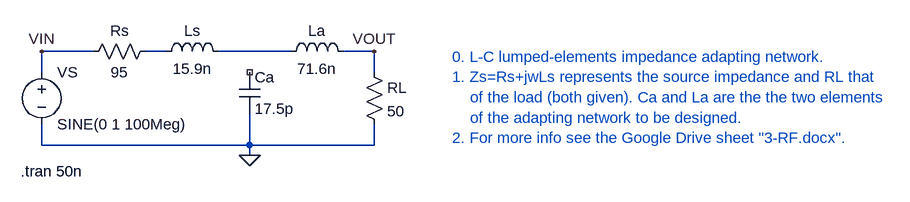
[diagram p0: schematic Impedance_Adapter.asc]
Impedance_Adapter.asc, the LTspice schematic file:
Version 4
SHEET 1 1412 680
WIRE 128 112 48 112
WIRE 240 112 208 112
WIRE 432 112 320 112
WIRE 560 112 512 112
WIRE 48 144 48 112
WIRE 560 144 560 112
WIRE 48 256 48 224
WIRE 368 256 368 208
WIRE 368 256 48 256
WIRE 560 256 560 224
WIRE 560 256 368 256
WIRE 368 272 368 256
FLAG 368 272 0
FLAG 48 112 VIN
FLAG 560 112 VOUT
SYMBOL voltage 48 128 R0
WINDOW 123 0 0 Left 2
WINDOW 39 0 0 Left 2
SYMATTR InstName VS
SYMATTR Value SINE(0 1 100Meg)
SYMBOL res 224 96 R90
WINDOW 0 0 56 VBottom 2
WINDOW 3 32 56 VTop 2
SYMATTR InstName Rs
SYMATTR Value 95
SYMBOL ind 224 128 R270
WINDOW 0 32 56 VTop 2
WINDOW 3 5 56 VBottom 2
SYMATTR InstName Ls
SYMATTR Value 15.9n
SYMBOL cap 352 144 R0
SYMATTR InstName Ca
SYMATTR Value 17.5p
SYMBOL ind 416 128 R270
WINDOW 0 32 56 VTop 2
WINDOW 3 5 56 VBottom 2
SYMATTR InstName La
SYMATTR Value 71.6n
SYMBOL res 544 128 R0
SYMATTR InstName RL
SYMATTR Value 50
TEXT 16 296 Left 2 !.tran 50n
TEXT 680 120 Left 2 ;0. L-C lumped-elements impedance adapting network.\n1. Zs=Rs+jwLs represents the source impedance and RL that\n    of the load (both given). Ca and La are the the two elements\n    of the adapting network to be designed.\n2. For more info see the Google Drive sheet "3-RF.docx".

The netlist it stands for:
* Impedance_Adapter.asc
VS VIN 0 SINE(0 1 100Meg)
Rs N001 VIN 95
Ls N001 N002 15.9n
Ca NC_01 0 17.5p
La N002 VOUT 71.6n
RL VOUT 0 50
.tran 50n
* 0. L-C lumped-elements impedance adapting network.
* 1. Zs=Rs+jwLs represents the source impedance and RL that
*     of the load (both given). Ca and La are the the two elements
*     of the adapting network to be designed.
* 2. For more info see the Google Drive sheet "3-RF.docx".
.backanno
.end